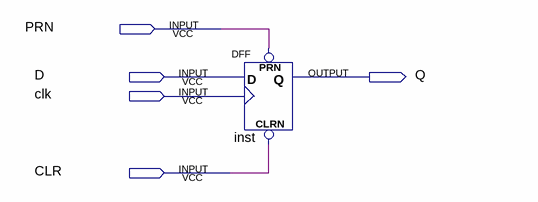
[diagram p0: schematic sheet]
// Quartus schematic aa.bdf as structural Verilog: 1 symbols, 5 pins
module aa (
  input  PRN,
  input  D,
  input  clk,
  input  CLR,
  output Q
);

  DFF inst (.CLRN(CLR), .CLK(clk), .D(D), .PRN(PRN), .Q(Q));
endmodule
